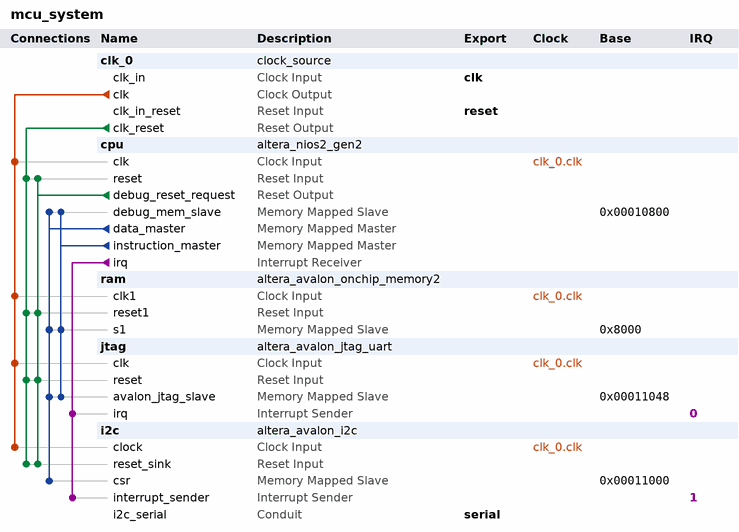
[diagram p0: system contents]
# Platform Designer (Qsys) system mcu_system, MAX 10 10M08SAU169C8G
# Parameters at their usual value, and those the tool derives, are not listed.
package require -exact qsys 18.1
create_system mcu_system
set_project_property DEVICE_FAMILY {MAX 10}
set_project_property DEVICE 10M08SAU169C8G

add_instance clk_0 clock_source 18.1
set_instance_parameter_value clk_0 clockFrequency 25000000

add_instance cpu altera_nios2_gen2 18.1
set_instance_parameter_value cpu dcache_size 2048
set_instance_parameter_value cpu exceptionSlave ram.s1
set_instance_parameter_value cpu icache_size 4096
set_instance_parameter_value cpu impl Tiny
set_instance_parameter_value cpu resetSlave ram.s1

add_instance ram altera_avalon_onchip_memory2 18.1
set_instance_parameter_value ram dataWidth 32
set_instance_parameter_value ram dualPort false
set_instance_parameter_value ram initMemContent true
set_instance_parameter_value ram initializationFileName onchip_mem.hex
set_instance_parameter_value ram memorySize 32768

add_instance jtag altera_avalon_jtag_uart 18.1
set_instance_parameter_value jtag simInteractiveOptions NO_INTERACTIVE_WINDOWS

add_instance i2c altera_avalon_i2c 18.1
set_instance_parameter_value i2c FIFO_DEPTH 4

# connections
add_connection clk_0.clk cpu.clk clock
add_connection clk_0.clk i2c.clock clock
add_connection clk_0.clk jtag.clk clock
add_connection clk_0.clk ram.clk1 clock
add_connection clk_0.clk_reset cpu.reset reset
add_connection clk_0.clk_reset i2c.reset_sink reset
add_connection clk_0.clk_reset jtag.reset reset
add_connection clk_0.clk_reset ram.reset1 reset
add_connection cpu.debug_reset_request cpu.reset reset
add_connection cpu.debug_reset_request i2c.reset_sink reset
add_connection cpu.debug_reset_request jtag.reset reset
add_connection cpu.debug_reset_request ram.reset1 reset
add_connection cpu.data_master cpu.debug_mem_slave avalon
set_connection_parameter_value cpu.data_master/cpu.debug_mem_slave baseAddress 0x00010800
add_connection cpu.data_master i2c.csr avalon
set_connection_parameter_value cpu.data_master/i2c.csr baseAddress 0x00011000
add_connection cpu.data_master jtag.avalon_jtag_slave avalon
set_connection_parameter_value cpu.data_master/jtag.avalon_jtag_slave baseAddress 0x00011048
add_connection cpu.data_master ram.s1 avalon
set_connection_parameter_value cpu.data_master/ram.s1 baseAddress 0x8000
add_connection cpu.instruction_master cpu.debug_mem_slave avalon
set_connection_parameter_value cpu.instruction_master/cpu.debug_mem_slave baseAddress 0x00010800
add_connection cpu.instruction_master jtag.avalon_jtag_slave avalon
set_connection_parameter_value cpu.instruction_master/jtag.avalon_jtag_slave baseAddress 0x00011048
add_connection cpu.instruction_master ram.s1 avalon
set_connection_parameter_value cpu.instruction_master/ram.s1 baseAddress 0x8000
add_connection cpu.irq i2c.interrupt_sender interrupt
set_connection_parameter_value cpu.irq/i2c.interrupt_sender irqNumber 1
add_connection cpu.irq jtag.irq interrupt
set_connection_parameter_value cpu.irq/jtag.irq irqNumber 0

# exported interfaces
add_interface clk clock sink
set_interface_property clk EXPORT_OF clk_0.clk_in
add_interface reset reset sink
set_interface_property reset EXPORT_OF clk_0.clk_in_reset
add_interface serial conduit end
set_interface_property serial EXPORT_OF i2c.i2c_serial

set_interconnect_requirement {$system} qsys_mm.clockCrossingAdapter HANDSHAKE
set_interconnect_requirement {$system} qsys_mm.enableEccProtection FALSE
set_interconnect_requirement {$system} qsys_mm.insertDefaultSlave FALSE
set_interconnect_requirement {$system} qsys_mm.maxAdditionalLatency 1

save_system mcu_system.qsys
